# Altium schematic sheet TMC2210 V10.SchDoc
size A4
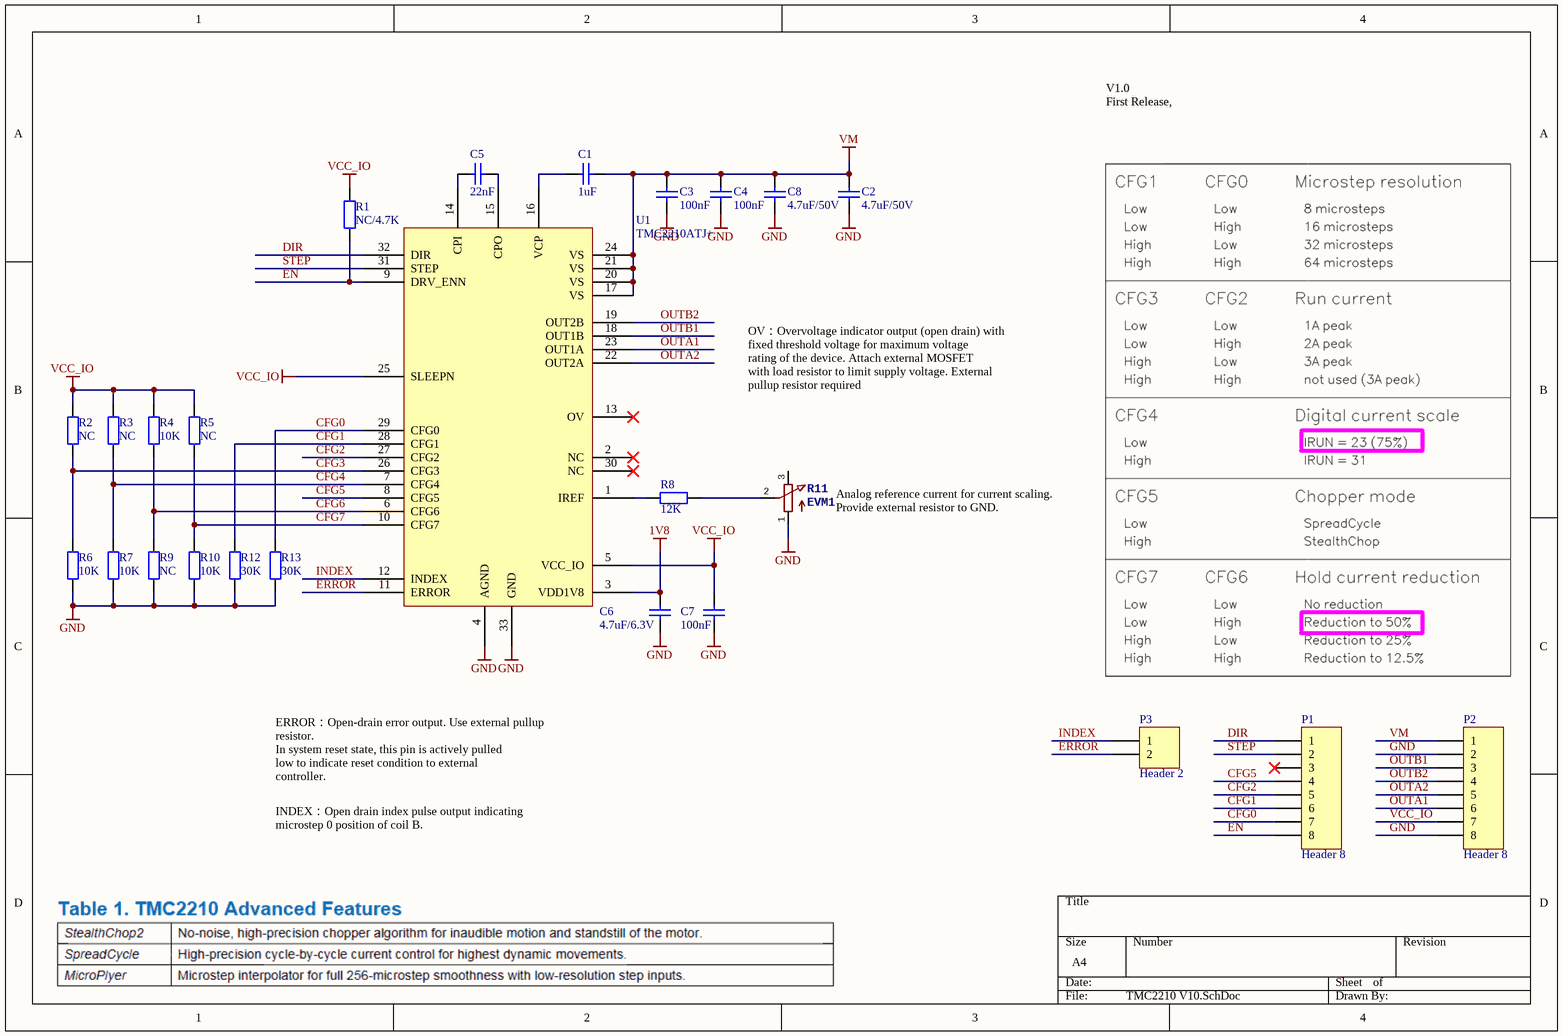
[diagram p0: TMC2210 V10.SchDoc]

## Parts
C1  1uF  [CAP0402_NS]
C2  4.7uF/50V  [CAP0805]
C3  100nF  [CAP0402_NS]
C4  100nF  [CAP0402_NS]
C5  22nF  [CAP0402_NS]
C6  4.7uF/6.3V  [CAP0402_NS]
C7  100nF  [CAP0402_NS]
C8  4.7uF/50V  [CAP0805]
P1  Header 8  [Header 1X8]
P2  Header 8  [Header 1X8]
P3  Header 2  [HDR1X2]
R1  NC/4.7K  [RES0402_NS]
R2  NC  [RES0402_NS]
R3  NC  [RES0402_NS]
R4  10K  [RES0402_NS]
R5  NC  [RES0402_NS]
R6  10K  [RES0402_NS]
R7  10K  [RES0402_NS]
R8  12K  [RES0402]
R9  NC  [RES0402_NS]
R10  10K  [RES0402_NS]
R11  EVM1USX30B54  [POT_EVM3R]
R12  30K  [RES0402_NS]
R13  30K  [RES0402_NS]
U1  TMC2210ATJ+  [QFN32(Atmel)]

## Nets
1V8: C6.1 U1.3(VDD1V8)
GND: C2.1 C3.1 C4.1 C6.2 C7.2 C8.1 P2.2 P2.8 R6.1 R7.1 R9.1 R10.1 R11.1(A) R12.1 R13.1 U1.4(AGND) U1.33(GND)
VCC_IO: C7.1 P2.7 R1.2 R2.2 R3.2 R4.2 R5.2 U1.5(VCC_IO) U1.25(SLEEPN)
VM: C1.2 C2.2 C3.2 C4.2 C8.2 P2.1 U1.17(VS) U1.20(VS) U1.21(VS) U1.24(VS)
CFG0: P1.7 R13.2 U1.29(CFG0)
CFG1: P1.6 R12.2 U1.28(CFG1)
CFG2: P1.5 U1.27(CFG2)
CFG3: R2.1 R6.2 U1.26(CFG3)
CFG4: R3.1 R7.2 U1.7(CFG4)
CFG5: P1.4 U1.8(CFG5)
CFG6: R4.1 R9.2 U1.6(CFG6)
CFG7: R5.1 R10.2 U1.10(CFG7)
DIR: P1.1 U1.32(DIR)
EN: P1.8 R1.1 U1.9(DRV_ENN)
ERROR: P3.2 U1.11(ERROR)
INDEX: P3.1 U1.12(INDEX)
OUTA1: P2.6 U1.23(OUT1A)
OUTA2: P2.5 U1.22(OUT2A)
OUTB1: P2.3 U1.18(OUT1B)
OUTB2: P2.4 U1.19(OUT2B)
STEP: P1.2 U1.31(STEP)
NetC1_1: C1.1 U1.16(VCP)
NetC5_1: C5.1 U1.14(CPI)
NetC5_2: C5.2 U1.15(CPO)
NetR8_1: R8.1 R11.2(S)
NetR8_2: R8.2 U1.1(IREF)

Not connected (* = marked no-connect by the designer): P1 3*; R11 3(E); U1 2(NC)* 13(OV)* 30(NC)*

## Notes on the sheet
- V1.0
  First Release,
- OV：Overvoltage indicator output (open drain) with
  fixed threshold voltage for maximum voltage
  rating of the device. Attach external MOSFET
  with load resistor to limit supply voltage. External
  pullup resistor required
- (near R11) Analog reference current for current scaling.
  Provide external resistor to GND.
- ERROR：Open-drain error output. Use external pullup
  resistor.
  In system reset state, this pin is actively pulled
  low to indicate reset condition to external
  controller.
- INDEX：Open drain index pulse output indicating
  microstep 0 position of coil B.

## Library data of the parts
C1-C8 = Capacitor
P1 P2 = Header 8: Header, 8-Pin; LatestRevisionDate: 17-Jul-2002; LatestRevisionNote: Re-released for DXP Platform.; Publisher: Altium Limited
P3 = Header 2: Header, 2-Pin; LatestRevisionDate: 17-Jul-2002; LatestRevisionNote: Re-released for DXP Platform.; Publisher: Altium Limited
R1-R10 R12 R13 = Resistor
R11 = POTEVM3R: Potentiometer